# Altium schematic sheet MCU.SchDoc
size A4
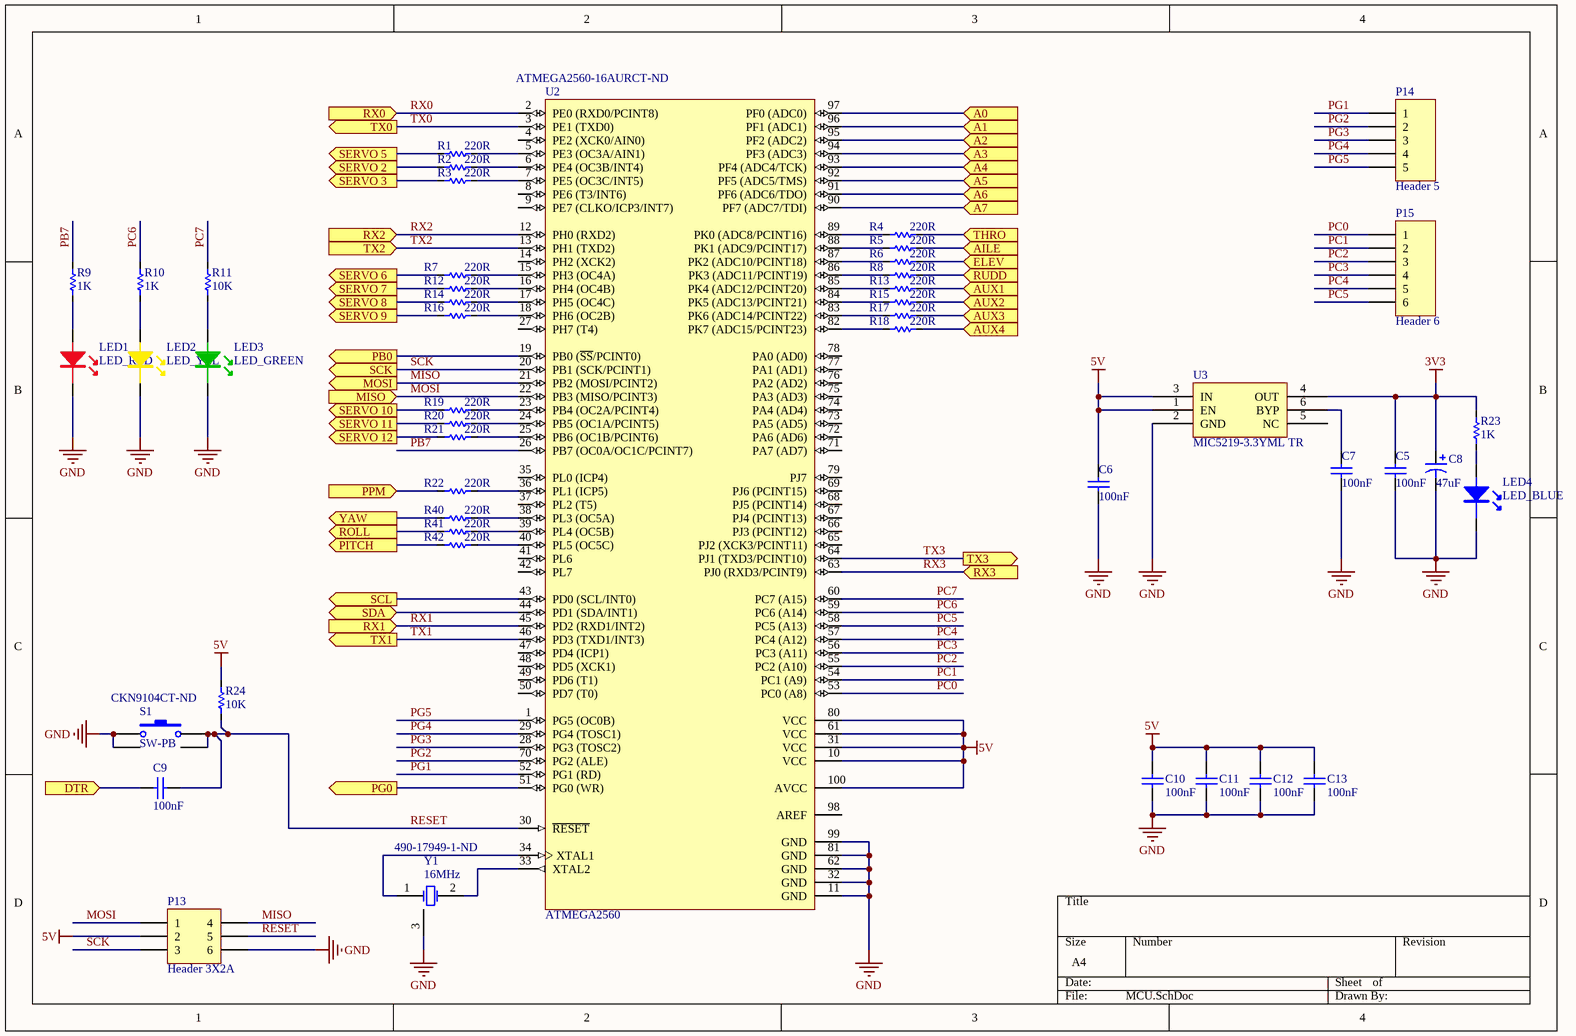
[diagram p0: MCU.SchDoc]

## Parts
C5  100nF  [C0603(1608)]
C6  100nF  [C0603(1608)]
C7  100nF  [C0603(1608)]
C8  47uF  [TANT_C1411(3528)]
C9  100nF  [C0603(1608)]
C10  100nF  [C0603(1608)]
C11  100nF  [C0603(1608)]
C12  100nF  [C0603(1608)]
C13  100nF  [C0603(1608)]
LED1  LED_RED  [L0805_RED]
LED2  LED_YEL  [L0805_YEL]
LED3  LED_GREEN  [L0805_GRE]
LED4  LED_BLUE  [L0603_BLU]
P13  Header 3X2A  [Pin Header 2x3 TH Pitch 2.54mm]
P14  Header 5  [PAD-1x5 2MM]
P15  Header 6  [PAD-1x6 2MM]
R1  220R  [R0603(1608)]
R2  220R  [R0603(1608)]
R3  220R  [R0603(1608)]
R4  220R  [R0603(1608)]
R5  220R  [R0603(1608)]
R6  220R  [R0603(1608)]
R7  220R  [R0603(1608)]
R8  220R  [R0603(1608)]
R9  1K  [R0603(1608)]
R10  1K  [R0603(1608)]
R11  10K  [R0603(1608)]
R12  220R  [R0603(1608)]
R13  220R  [R0603(1608)]
R14  220R  [R0603(1608)]
R15  220R  [R0603(1608)]
R16  220R  [R0603(1608)]
R17  220R  [R0603(1608)]
R18  220R  [R0603(1608)]
R19  220R  [R0603(1608)]
R20  220R  [R0603(1608)]
R21  220R  [R0603(1608)]
R22  220R  [R0603(1608)]
R23  1K  [R0603(1608)]
R24  10K  [R0603(1608)]
R40  220R  [R0603(1608)]
R41  220R  [R0603(1608)]
R42  220R  [R0603(1608)]
S1  SW-PB  Supplier Part Number 1: CKN9104CT-ND  [SWITCH_PTS525SM15]
U2  ATMEGA2560  Supplier Part Number 1: ATMEGA2560-16AURCT-ND  [100A_M]
U3  MIC5219-3.3YML TR  [6-ML]
Y1  16MHz  Supplier Part Number 1: 490-17949-1-ND  [XTAL_RESONATOR_3.2x1.3]

## Ports
A0 (in), A1 (in), A2 (in), A3 (in), A4 (in), A5 (in), A6 (in), A7 (in), AILE (in), AUX1 (in), AUX2 (in), AUX3 (in), AUX4 (in), DTR (in), ELEV (in), MISO (in), MOSI (out), PB0 (out), PG0 (out), PITCH (out), PPM (in), ROLL (out), RUDD (in), RX0 (in), RX1 (in), RX2 (in), RX3 (in), SCK (out), SCL (out), SDA (bidir), SERVO 2 (out), SERVO 3 (out), SERVO 5 (out), SERVO 6 (out), SERVO 7 (out), SERVO 8 (out), SERVO 9 (out), SERVO 10 (out), SERVO 11 (out), SERVO 12 (out), THRO (in), TX0 (out), TX1 (out), TX2 (in), TX3 (out), YAW (out)

## Nets
3V3: C5.2 C8.1 R23.2 U3.4(OUT)
5V: C6.2 C10.2 C11.2 C12.2 C13.2 P13.2 R24.1 U2.10(VCC) U2.31(VCC) U2.61(VCC) U2.80(VCC) U2.100(AVCC) U3.1(EN) U3.3(IN)
GND: C5.1 C6.1 C7.1 C8.2 C10.1 C11.1 C12.1 C13.1 LED1.2(K) LED2.2(K) LED3.2(K) LED4.2(K) P13.6 S1.1 S1.2 U2.11(GND) U2.32(GND) U2.62(GND) U2.81(GND) U2.99(GND) U3.2(GND) Y1.3(GND)
A0: U2.97(PF0_(ADC0)) ; port A0
A1: U2.96(PF1_(ADC1)) ; port A1
A2: U2.95(PF2_(ADC2)) ; port A2
A3: U2.94(PF3_(ADC3)) ; port A3
A4: U2.93(PF4_(ADC4/TCK)) ; port A4
A5: U2.92(PF5_(ADC5/TMS)) ; port A5
A6: U2.91(PF6_(ADC6/TDO)) ; port A6
A7: U2.90(PF7_(ADC7/TDI)) ; port A7
AILE: R5.2 ; port AILE
AUX1: R13.2 ; port AUX1
AUX2: R15.2 ; port AUX2
AUX3: R17.2 ; port AUX3
AUX4: R18.2 ; port AUX4
DTR: C9.1 ; port DTR
ELEV: R6.2 ; port ELEV
MISO: P13.4 U2.21(PB2_(MOSI/PCINT2)) ; port MOSI
MOSI: P13.1 U2.22(PB3_(MISO/PCINT3)) ; port MISO
PB0: U2.19(PB0_(~{SS}/PCINT0)) ; port PB0
PB7: R9.2 U2.26(PB7_(OC0A/OC1C/PCINT7))
PC0: P15.1 U2.53(PC0_(A8))
PC1: P15.2 U2.54(PC1_(A9))
PC2: P15.3 U2.55(PC2_(A10))
PC3: P15.4 U2.56(PC3_(A11))
PC4: P15.5 U2.57(PC4_(A12))
PC5: P15.6 U2.58(PC5_(A13))
PC6: R10.2 U2.59(PC6_(A14))
PC7: R11.2 U2.60(PC7_(A15))
PG0: U2.51(PG0_(WR)) ; port PG0
PG1: P14.1 U2.52(PG1_(RD))
PG2: P14.2 U2.70(PG2_(ALE))
PG3: P14.3 U2.28(PG3_(TOSC2))
PG4: P14.4 U2.29(PG4_(TOSC1))
PG5: P14.5 U2.1(PG5_(OC0B))
PITCH: R42.1 ; port PITCH
PPM: R22.1 ; port PPM
RESET: C9.2 P13.5 R24.2 S1.3 S1.4 U2.30(~{RESET})
ROLL: R41.1 ; port ROLL
RUDD: R8.2 ; port RUDD
RX0: U2.2(PE0_(RXD0/PCINT8)) ; port RX0
RX1: U2.45(PD2_(RXD1/INT2)) ; port RX1
RX2: U2.12(PH0_(RXD2)) ; port RX2
RX3: U2.63(PJ0_(RXD3/PCINT9)) ; port RX3
SCK: P13.3 U2.20(PB1_(SCK/PCINT1)) ; port SCK
SCL: U2.43(PD0_(SCL/INT0)) ; port SCL
SDA: U2.44(PD1_(SDA/INT1)) ; port SDA
SERVO 2: R2.1 ; port SERVO 2
SERVO 3: R3.1 ; port SERVO 3
SERVO 5: R1.1 ; port SERVO 5
SERVO 6: R7.1 ; port SERVO 6
SERVO 7: R12.1 ; port SERVO 7
SERVO 8: R14.1 ; port SERVO 8
SERVO 9: R16.1 ; port SERVO 9
SERVO 10: R19.1 ; port SERVO 10
SERVO 11: R20.1 ; port SERVO 11
SERVO 12: R21.1 ; port SERVO 12
THRO: R4.2 ; port THRO
TX0: U2.3(PE1_(TXD0)) ; port TX0
TX1: U2.46(PD3_(TXD1/INT3)) ; port TX1
TX2: U2.13(PH1_(TXD2)) ; port TX2
TX3: U2.64(PJ1_(TXD3/PCINT10)) ; port TX3
YAW: R40.1 ; port YAW
NetC7_2: C7.2 U3.6(BYP)
NetLED1_1: LED1.1(A) R9.1
NetLED2_1: LED2.1(A) R10.1
NetLED3_1: LED3.1(A) R11.1
NetLED4_1: LED4.1(A) R23.1
NetR1_2: R1.2 U2.5(PE3_(OC3A/AIN1))
NetR2_2: R2.2 U2.6(PE4_(OC3B/INT4))
NetR3_2: R3.2 U2.7(PE5_(OC3C/INT5))
NetR4_1: R4.1 U2.89(PK0_(ADC8/PCINT16))
NetR5_1: R5.1 U2.88(PK1_(ADC9/PCINT17))
NetR6_1: R6.1 U2.87(PK2_(ADC10/PCINT18))
NetR7_2: R7.2 U2.15(PH3_(OC4A))
NetR8_1: R8.1 U2.86(PK3_(ADC11/PCINT19))
NetR12_2: R12.2 U2.16(PH4_(OC4B))
NetR13_1: R13.1 U2.85(PK4_(ADC12/PCINT20))
NetR14_2: R14.2 U2.17(PH5_(OC4C))
NetR15_1: R15.1 U2.84(PK5_(ADC13/PCINT21))
NetR16_2: R16.2 U2.18(PH6_(OC2B))
NetR17_1: R17.1 U2.83(PK6_(ADC14/PCINT22))
NetR18_1: R18.1 U2.82(PK7_(ADC15/PCINT23))
NetR19_2: R19.2 U2.23(PB4_(OC2A/PCINT4))
NetR20_2: R20.2 U2.24(PB5_(OC1A/PCINT5))
NetR21_2: R21.2 U2.25(PB6_(OC1B/PCINT6))
NetR22_2: R22.2 U2.36(PL1_(ICP5))
NetR40_2: R40.2 U2.38(PL3_(OC5A))
NetR41_2: R41.2 U2.39(PL4_(OC5B))
NetR42_2: R42.2 U2.40(PL5_(OC5C))
NetU2_33: U2.33(XTAL2) Y1.2(OSC2)
NetU2_34: U2.34(XTAL1) Y1.1(OSC1)

Not connected (* = marked no-connect by the designer): U2 4(PE2_(XCK0/AIN0)) 8(PE6_(T3/INT6)) 9(PE7_(CLKO/ICP3/INT7)) 14(PH2_(XCK2)) 27(PH7_(T4)) 35(PL0_(ICP4)) 37(PL2_(T5)) 41(PL6) 42(PL7) 47(PD4_(ICP1)) 48(PD5_(XCK1)) 49(PD6_(T1)) 50(PD7_(T0)) 65(PJ2_(XCK3/PCINT11)) 66(PJ3_(PCINT12)) 67(PJ4_(PCINT13)) 68(PJ5_(PCINT14)) 69(PJ6_(PCINT15)) 71(PA7_(AD7)) 72(PA6_(AD6)) 73(PA5_(AD5)) 74(PA4_(AD4)) 75(PA3_(AD3)) 76(PA2_(AD2)) 77(PA1_(AD1)) 78(PA0_(AD0)) 79(PJ7) 98(AREF); U3 5(NC)

## Library data of the parts
C5-C7 C9-C13 = Cap: Capacitor
C8 = Cap Pol1: Tantalum Capacitor
P13 = Header 3X2A: JTAG
P14 = Header 5: Header, 5-Pin; LatestRevisionDate: 17-Jul-2002; LatestRevisionNote: Re-released for DXP Platform.; Publisher: Altium Limited
P15 = Header 6: Header, 6-Pin; LatestRevisionDate: 17-Jul-2002; LatestRevisionNote: Re-released for DXP Platform.; Publisher: Altium Limited
R1-R24 R40-R42 = R: Resistor
S1 = SW-PB: Switch; Manufacturer: ITT C&K; Manufacturer Part Number: PTS525SM15SMTR2LFS; Mechanical Life: 1000000Cycles; Actuator Material: Nylon,Polyamide; Illumination Type: Non-Illuminated; Operating Force: 160gf; Throw Configuration: SPST; Switch Travel: 0.25mm; Switch Function: Off-Mom; Actuator Type: Standard; Supplier 1: Digi-Key; RoHS: Yes; Stock 1: 389377; Pricing 1: 1 = 0.33000, 10 = 0.32000, 25 = 0.30840, 50 = 0.29680, 100 = 0.28540, 250 = 0.26260, 500 = 0.22834, 1000 = 0.19409 (USD); Mount: Surface Mount; Min Operating Temperature: -20°C; Max Operating Temperature: 70°C; Packaging: Cut Tape; Termination: Gull Wing; Lead Free: Lead Free
U2 = IC: IC MCU 8BIT 256KB FLASH 100TQFP; Manufacturer: Atmel; Manufacturer Part Number: ATMEGA2560-16AUR; Core Processor: AVR; Core Size: 8-Bit; Speed: 16MHz; Connectivity: EBI/EMI, I²C, SPI, UART/USART; Peripherals: Brown-out Detect/Reset, POR, PWM, WDT; Number of I/O: 86; Program Memory Size: 256KB (128K x 16); EEPROM Size: 4K x 8; RAM Size: 8K x 8; Voltage - Supply (Vcc/Vdd): 4.5 V ~ 5.5 V; Data Converters: A/D 16x10b; Oscillator Type: Internal; Supplier 1: Digi-Key; RoHS: RoHS Compliant; Category: Integrated Circuits (ICs); Stock 1: 9312; Pricing 1: 1=17.28, 10=15.685, 25=14.5428, 100=13.3245, 250=12.1824, 500=11.34486 (USD); Packaging: Cut Tape (CT); Program Memory Type: FLASH; Operating Temperature: -40°C ~ 85°C; Package / Case: 100-TQFP; Supplier Device Package: 100-TQFP (14x14); ComponentLink1URL: http://www.atmel.com/Images/Atmel-2549-8-bit-AVR-Microcontroller-ATmega640-1280-1281-2560-2561_Summary.pdf; ComponentLink1Description: http://www.atmel.com/Images/Atmel-2549-8-bit-AVR-Microcontroller-ATmega640-1280-1281-2560-2561_Summary.pdf
U3 = MIC5219-3.3YML: IC REG LDO 3.3V 0.5A 6MLF; Manufacturer: Micrel Inc.; Regulator Topology: Positive Fixed; Current - Output: 500mA; Voltage - Dropout (Typical): 0.35V @ 500mA; Number of Regulators: 1; Voltage - Input: Up to 12V; Supplier 1: Digi-Key; Manufacturer Part Number: MIC5219-3.3YML TR; RoHS: RoHS Compliant; Category: Integrated Circuits (ICs); Stock 1: 10244; Pricing 1: 1=2.74, 10=2.477, 25=2.2188, 100=1.9952, 250=1.7716, 500=1.548, 1000=1.2814, 2500=1.1954 (USD); Packaging: Cut Tape (CT); Voltage - Output: 3.3V; Current - Limit (Min): -; Operating Temperature: -40°C ~ 125°C; Mounting Type: Surface Mount; Package / Case: 6-VQFN Exposed Pad, 6-MLF®; Supplier Device Package: 6-MLF® (2x2); ComponentLink1URL: http://www.micrel.com/_PDF/mic5219.pdf; ComponentLink1Description: http://www.micrel.com/_PDF/mic5219.pdf; Supplier Part Number 1: 576-2768-1-ND
Y1 = XTAL: CER RES 16.0000MHZ 15PF SMD AUTO; Supplier 1: Digi-Key